# Altium schematic sheet CAN_BUS.SchDoc
size A3; SheetNumber: 2; SheetTotal: 2
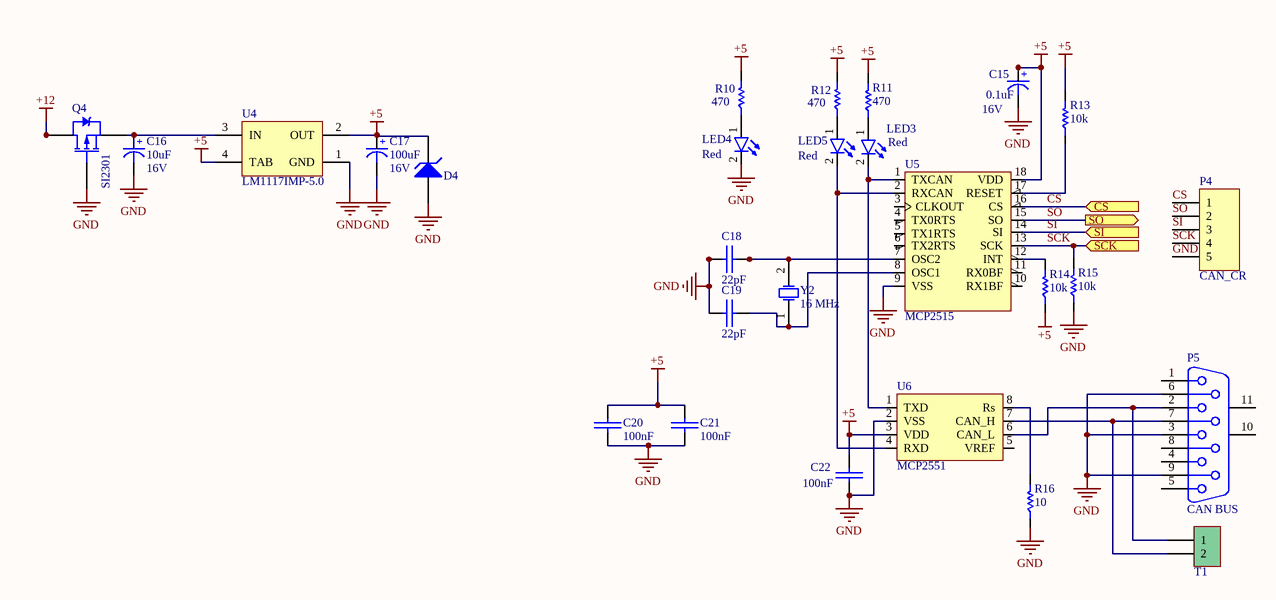
[diagram p0: CAN_BUS.SchDoc]

## Parts
C15  Voltage: 16V  [CAPP 1206 (3216X18L) Size A]  (hidden comment: 0.1uF)
C16  Voltage: 16V  [CAPP 1206 (3216X18L) Size A]  (hidden comment: 10uF)
C17  Voltage: 16V  [CAPP 1206 (3216X18L) Size A]  (hidden comment: 100uF)
C18  22pF  [SMD_CAP_1206]
C19  22pF  [SMD_CAP_1206]
C20  100nF  [SMD_CAP_1206]
C21  100nF  [SMD_CAP_1206]
C22  100nF  [SMD_CAP_1206]
D4  Diode Zener  [Diode 1W]  (value not drawn)
LED3  Red  [LED-5mm]
LED4  Red  [LED-5mm]
LED5  Red  [LED-5mm]
P4  CAN_CR  [HDR1X5]
P5  CAN BUS  [DB9 Female]
Q4  SI2301  [SOT-23_M]
R10  470  [RES 1206 (3216X08L)]
R11  470  [RES 1206 (3216X08L)]
R12  470  [RES 1206 (3216X08L)]
R13  10k  [RES 1206 (3216X08L)]
R14  10k  [RES 1206 (3216X08L)]
R15  10k  [RES 1206 (3216X08L)]
R16  10  [RES 1206 (3216X08L)]
T1  Phoenix terminal  [Phoenix2]  (value not drawn)
U4  LM1117IMP-5.0  [MP04A_N]
U5  MCP2515  [SOIC18-N]
U6  MCP2551  [SOIC8]
Y2  16 MHz  [XTAL]

## Ports
CS (in), SCK (in), SI (in), SO (out)

## Nets
+5: C15.1(+) C17.1(+) C20.1(+) C21.1(+) C22.1(+) D4.2(K) R10.2 R11.2 R12.2 R13.2 R14.1 U4.2(OUT) U4.4(TAB) U5.18(VDD) U6.3(VDD)
+12: Q4.2(D)
GND: C15.2(-) C16.2(-) C17.2(-) C18.1(+) C19.1(+) C20.2(-) C21.2(-) C22.2(-) D4.1(A) LED4.2(K) P4.5 P5.3 P5.6 P5.9 Q4.1(G) R15.1 R16.1 U4.1(GND) U5.9(VSS) U6.2(VSS)
CS: P4.1 U5.16(CS) ; port CS
SCK: P4.4 R15.2 U5.13(SCK) ; port SCK
SI: P4.3 U5.14(SI) ; port SI
SO: P4.2 U5.15(SO) ; port SO
NetC16_1: C16.1(+) Q4.3(S) U4.3(IN)
NetC18_2: C18.2(-) U5.7(OSC2) Y2.2(OSC2)
NetC19_2: C19.2(-) U5.8(OSC1) Y2.1(OSC1)
NetLED3_1: LED3.1(A) R11.1
NetLED3_2: LED3.2(K) U5.1(TXCAN) U6.1(TXD)
NetLED4_1: LED4.1(A) R10.1
NetLED5_1: LED5.1(A) R12.1
NetLED5_2: LED5.2(K) U5.2(RXCAN) U6.4(RXD)
NetP5_2: P5.2 T1.1 U6.6(CAN_L)
NetP5_7: P5.7 T1.2 U6.7(CAN_H)
NetR13_1: R13.1 U5.17(RESET)
NetR14_2: R14.2 U5.12(INT)
NetR16_2: R16.2 U6.8(Rs)

Not connected (* = marked no-connect by the designer): P5 1 4 5 8 10(MH1) 11(MH2); U5 3(CLKOUT) 4(TX0RTS) 5(TX1RTS) 6(TX2RTS) 10(RX1BF) 11(RX0BF); U6 5(VREF)

## Library data of the parts
C15-C17 = Cap-Polar: Polar Capacitor; Designer: Saeid Jorablo; Organazation: ControTec; Adding Date: 1387/12/20
  C15: Value: 0.1uF
  C16: VALUE: 10uF
  C17: Value: 100uF
C18-C22 = Cap-Bipolar: Bipolar Capacitor; Voltage: 100V; Designer: Saeid Jorablo; Organazation: ControTec; Adding Date: 1387/12/20
  C18 C19: Value: 22pF
  C20-C22: Value: 100nF
D4 = Diode Zener: Zener Diode; Designer: Saeid Jorablo; Company: E.P.I.L; Voltage: 5 V; Design Date: 2011/11/02
LED3-LED5 = LED: Designer: Saeid Jorablo; Organazation: ControTec; Adding Date: 1387/12/22; Color: Red
P4 = Header 5: Header, 5-Pin; LatestRevisionDate: 17-Jul-2002; LatestRevisionNote: Re-released for DXP Platform.; Publisher: Altium Limited
P5 = DB9 Connector: Receptacle Assembly, 9 Position, Right Angle; PackageDocument: O; Positions: 9; Published: 15-Jun-2001; LatestRevisionDate: 17-Jul-2002; LatestRevisionNote: Re-released for DXP Platform.; DatasheetDocument: 1-Sep-1999; PackageReference: 788750; Publisher: Altium Limited; Orientation: Right Angle; Gender: Receptacle
Q4 = PMOS-2: P-Channel Power MOSFET; Note: Pin 4 not drawn and electrically connected to Pin 2.; Published: 8-Jun-2000; LatestRevisionDate: 17-Jul-2002; LatestRevisionNote: Re-released for DXP Platform.; DatasheetVersion: PD-9.390D; PackageVersion: Feb-1997; PackageReference: TO-220AB; Publisher: Altium Limited; PackageDescription: TO, Thru-Hole, Vertical, Heatsink Mounted; 3 In-Line Leads; Pitch 2.54 mm; ComponentLink1Description: Manufacturer Link; ComponentLink1URL: http://www.irf.com/
R10-R16 = Resistor
  R10-R12: Value: 470
  R13-R15: Value: 10k
  R16: Value: 10
T1 = Phoenix terminal 2: Terminal 2 Pin; Designer: Seyed Mohsen Ghasemain; E-mail: picpars@gmail.com; ComponentLinkURL: www.picpars.com
U4 = LM1117IMP-x.x: 5 Volt, 800mA Low-Dropout Linear Regulator, 4-pin SOT-223; PartNumber: LM1117IMP-3.3; Manufacturer: National Semiconductor; PackageTopMarking: XYTT*N05B; PowerWise: N; CompType: LDO IC; Published: 4-Dec-2008; DatasheetVersion: Apr-2006; PackageVersion: revB, Apr-2003; PackageReference: MP04A; Publisher: Altium Limited; PackageDescription: Molded SOT-223, 6.50 x 3.56 x 1.6mm Body, 4 Lead, 2.3mm Pitch; Supplier 1: Farnell; Supplier Part Number 1: 7614123; RoHS: N; PinCount: 4; Code_JEDEC: TO-261-AA; Code_IPC: SOT223-4; ComponentLink1Description: LM1117 Datasheet; ComponentLink1URL: http://www.national.com/ds/LM/LM1117.pdf; ComponentLink2Description: LM1117 Web Page; ComponentLink2URL: http://www.national.com/pf/LM/LM1117.html; ComponentLink3Description: MP04A Package Page; ComponentLink3URL: http://www.national.com/packaging/folders/mp04a.html
U5 = MCP2515: CAN Bus controller
U6 = MCP2551: CAN Bus controller
Y2 = XTAL: XTAL Crystal; Company: E.P.I.L; Design Date: 11/04/2011; Value: 16 MHz